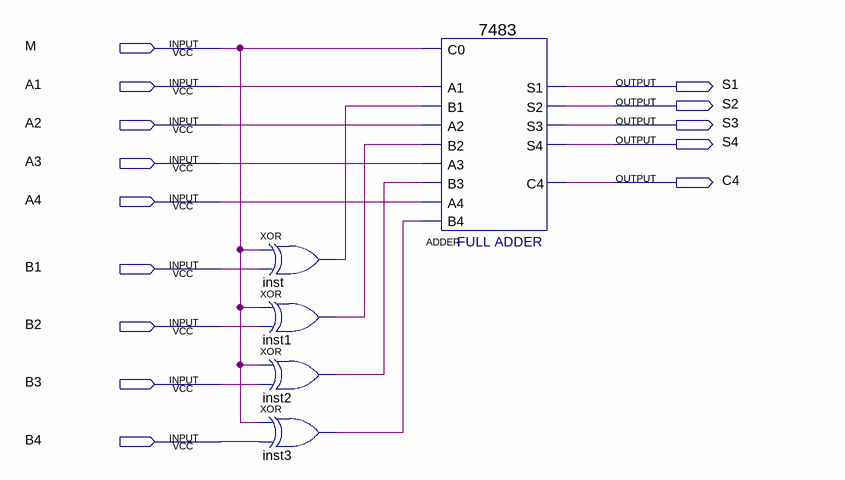
[diagram p0: schematic sheet]
// Quartus schematic HW07.bdf as structural Verilog: 5 symbols, 14 pins
module HW07 (
  input  M,
  input  A1,
  input  A2,
  input  A3,
  input  A4,
  input  B1,
  input  B2,
  input  B3,
  input  B4,
  output S1,
  output S2,
  output S3,
  output S4,
  output C4
);

  wire inst1_out, inst2_out, inst3_out, inst_out;

  xor inst (inst_out, M, B1);
  xor inst1 (inst1_out, M, B2);
  xor inst2 (inst2_out, M, B3);
  xor inst3 (inst3_out, M, B4);
  \7483  ADDER (
    .B4(inst3_out), .C0(M), .A1(A1), .A2(A2), .B1(inst_out), .B2(inst1_out), .A3(A3), .B3(inst2_out),
    .A4(A4), .S3(S3), .S4(S4), .S2(S2), .C4(C4), .S1(S1));
endmodule
